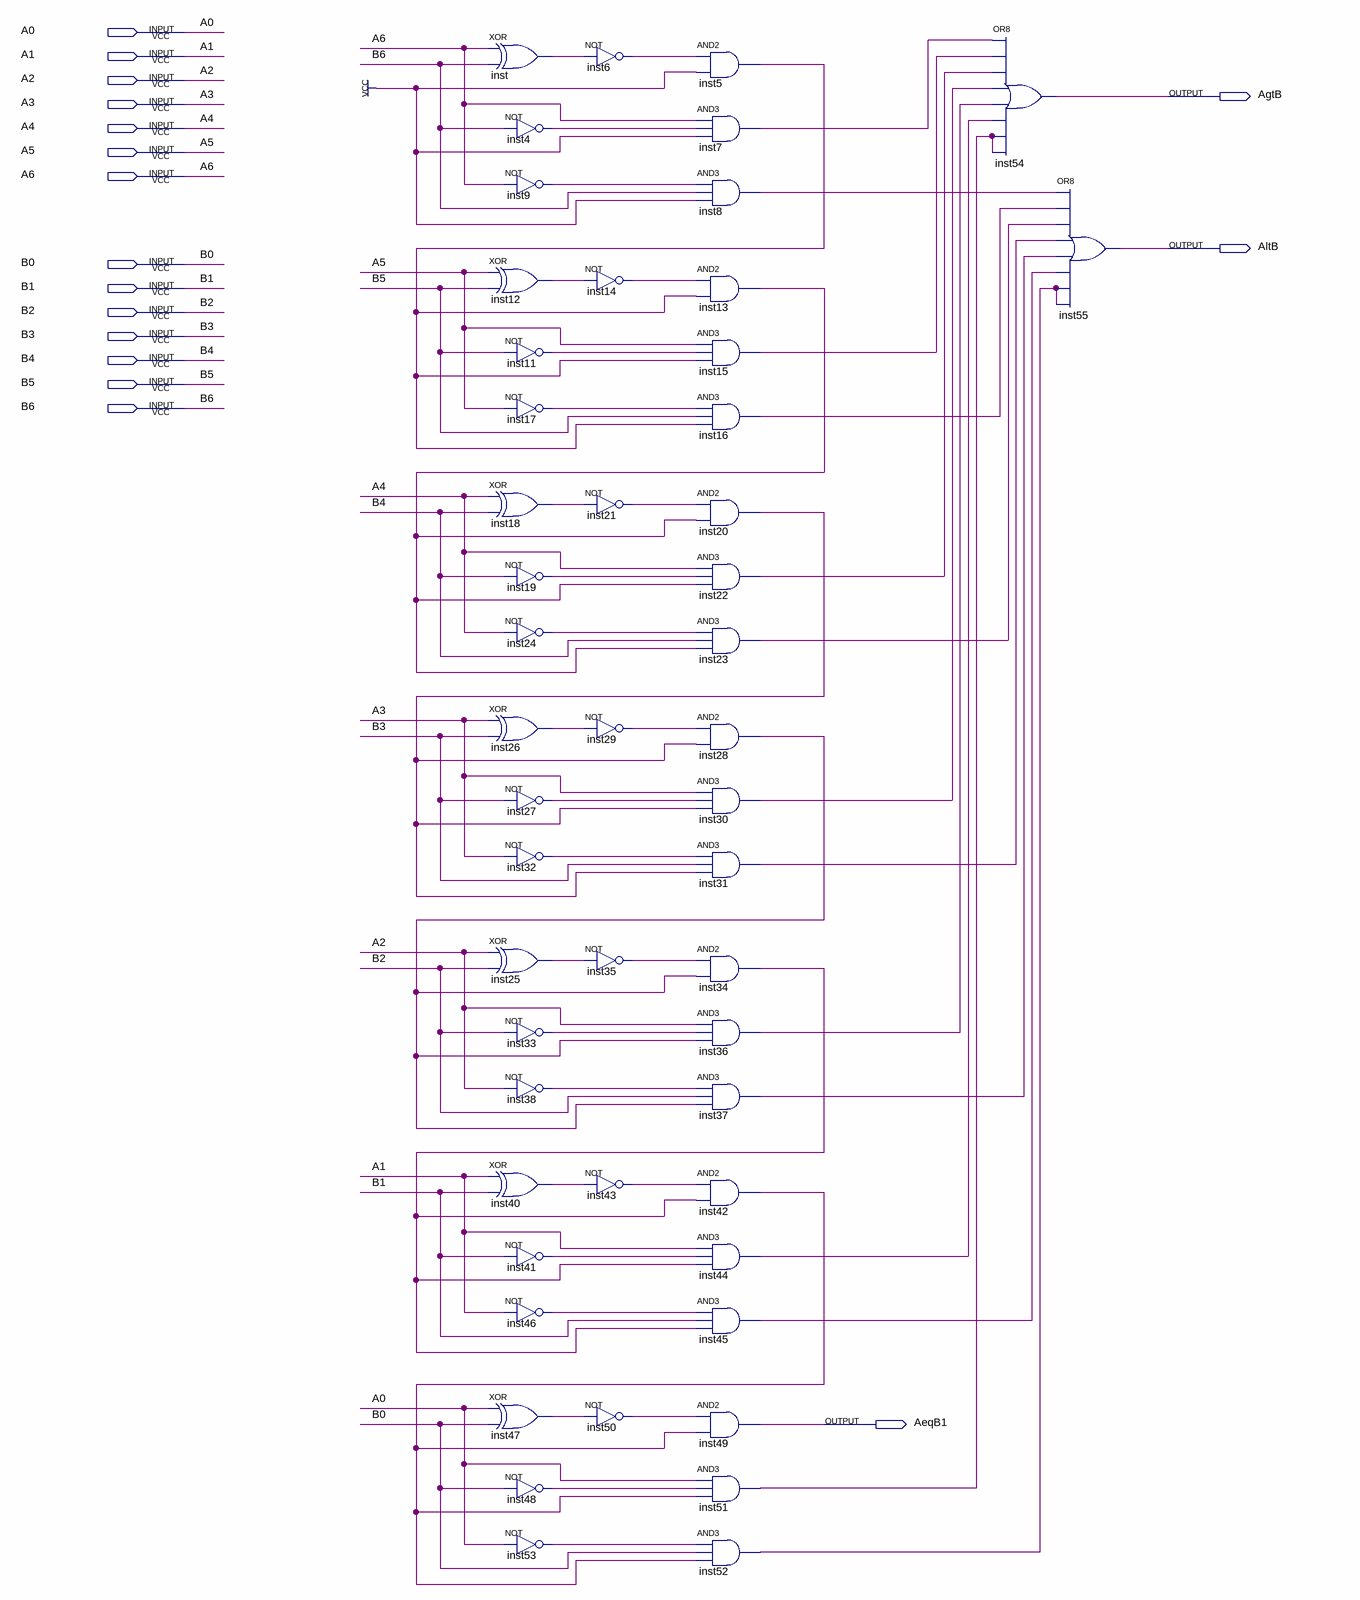
[diagram p0: schematic sheet]
// Quartus schematic comparador_magnitude.bdf as structural Verilog: 51 symbols, 17 pins
module comparador_magnitude (
  input  A0,
  input  A1,
  input  A2,
  input  A3,
  input  A4,
  input  A5,
  input  A6,
  input  B0,
  input  B1,
  input  B2,
  input  B3,
  input  B4,
  input  B5,
  input  B6,
  output AgtB,
  output AltB,
  output AeqB1
);

  wire inst4_out, inst5_out, inst6_out, inst7_out, inst8_out, inst9_out, inst11_out, inst12_out, inst13_out,
       inst14_out, inst15_out, inst16_out, inst17_out, inst18_out, inst19_out, inst20_out, inst21_out,
       inst22_out, inst23_out, inst24_out, inst25_out, inst26_out, inst27_out, inst28_out, inst29_out,
       inst30_out, inst31_out, inst32_out, inst33_out, inst34_out, inst35_out, inst36_out, inst37_out,
       inst38_out, inst40_out, inst41_out, inst42_out, inst43_out, inst44_out, inst45_out, inst46_out,
       inst47_out, inst48_out, inst50_out, inst51_out, inst52_out, inst53_out, inst_out;

  xor inst (inst_out, A6, B6);
  xor inst12 (inst12_out, A5, B5);
  xor inst18 (inst18_out, A4, B4);
  xor inst26 (inst26_out, A3, B3);
  xor inst25 (inst25_out, A2, B2);
  xor inst40 (inst40_out, A1, B1);
  xor inst47 (inst47_out, A0, B0);
  not inst4 (inst4_out, B6);
  not inst9 (inst9_out, A6);
  not inst11 (inst11_out, B5);
  not inst17 (inst17_out, A5);
  not inst19 (inst19_out, B4);
  not inst24 (inst24_out, A4);
  not inst27 (inst27_out, B3);
  not inst32 (inst32_out, A3);
  not inst33 (inst33_out, B2);
  not inst38 (inst38_out, A2);
  not inst41 (inst41_out, B1);
  not inst46 (inst46_out, A1);
  not inst48 (inst48_out, B0);
  not inst53 (inst53_out, A0);
  not inst6 (inst6_out, inst_out);
  not inst14 (inst14_out, inst12_out);
  not inst21 (inst21_out, inst18_out);
  not inst29 (inst29_out, inst26_out);
  not inst35 (inst35_out, inst25_out);
  not inst43 (inst43_out, inst40_out);
  not inst50 (inst50_out, inst47_out);
  and inst5 (inst5_out, inst6_out, 1'b1);
  and inst7 (inst7_out, A6, inst4_out, 1'b1);
  and inst8 (inst8_out, inst9_out, B6, 1'b1);
  and inst13 (inst13_out, inst14_out, inst5_out);
  and inst15 (inst15_out, A5, inst11_out, inst5_out);
  and inst16 (inst16_out, inst17_out, B5, inst5_out);
  and inst20 (inst20_out, inst21_out, inst13_out);
  and inst22 (inst22_out, A4, inst19_out, inst13_out);
  and inst23 (inst23_out, inst24_out, B4, inst13_out);
  and inst28 (inst28_out, inst29_out, inst20_out);
  and inst30 (inst30_out, A3, inst27_out, inst20_out);
  and inst31 (inst31_out, inst32_out, B3, inst20_out);
  and inst34 (inst34_out, inst35_out, inst28_out);
  and inst36 (inst36_out, A2, inst33_out, inst28_out);
  and inst37 (inst37_out, inst38_out, B2, inst28_out);
  and inst42 (inst42_out, inst43_out, inst34_out);
  and inst44 (inst44_out, A1, inst41_out, inst34_out);
  and inst45 (inst45_out, inst46_out, B1, inst34_out);
  and inst49 (AeqB1, inst50_out, inst42_out);
  and inst51 (inst51_out, A0, inst48_out, inst42_out);
  and inst52 (inst52_out, inst53_out, B0, inst42_out);
  or inst54 (AgtB, inst7_out, inst15_out, inst22_out, inst30_out, inst36_out, inst44_out, inst51_out, inst51_out);
  or inst55 (AltB, inst8_out, inst16_out, inst23_out, inst31_out, inst37_out, inst45_out, inst52_out, inst52_out);
endmodule
